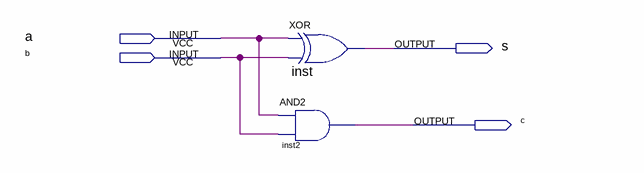
[diagram p0: schematic sheet]
// Quartus schematic HA.bdf as structural Verilog: 2 symbols, 4 pins
module HA (
  input  a,
  input  b,
  output s,
  output c
);

  xor inst (s, a, b);
  and inst2 (c, a, b);
endmodule
